# EAGLE schematic ws2812_wyswietlacz (EAGLE 9.2.0)
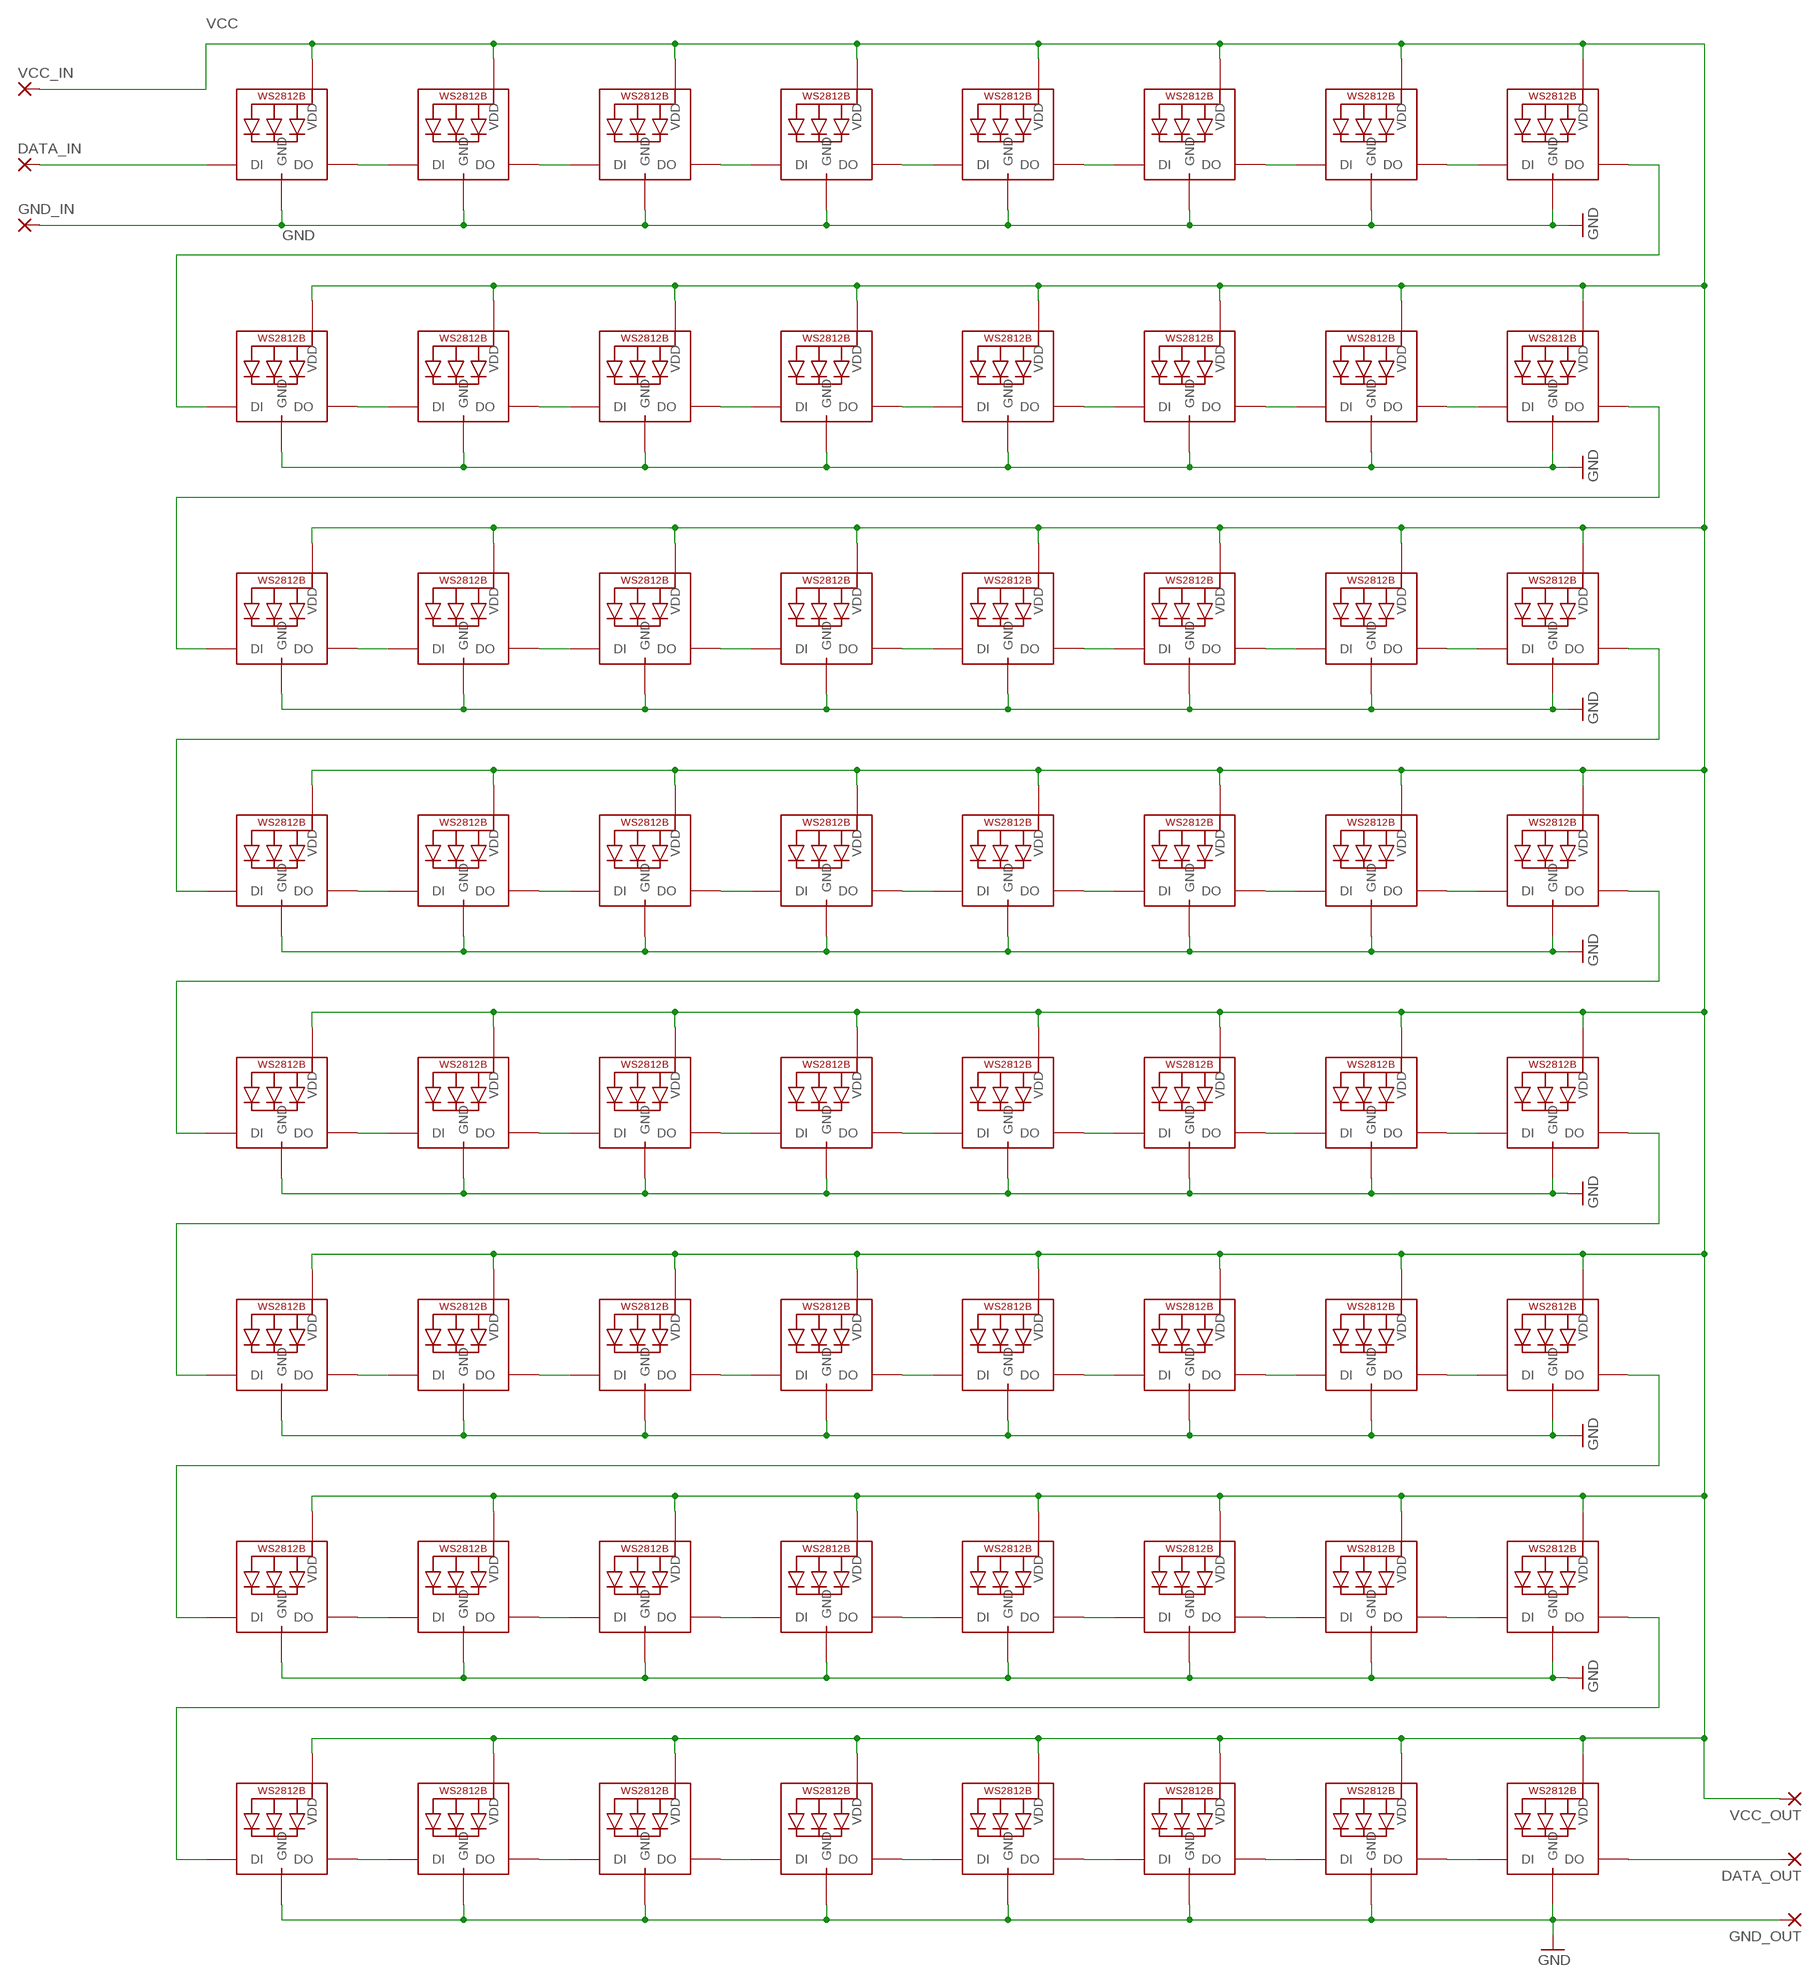
[diagram p0: schematic, sheet 1]

## Parts
DATA_IN  2,54/1,0  [2,54/1,0]
DATA_OUT  2,54/1,0  [2,54/1,0]
GND_IN  2,54/1,0  [2,54/1,0]
GND_OUT  2,54/1,0  [2,54/1,0]
LED1  WS2812B_5050N  [WS2812B-NARROW]
LED2  WS2812B_5050N  [WS2812B-NARROW]
LED3  WS2812B_5050N  [WS2812B-NARROW]
LED4  WS2812B_5050N  [WS2812B-NARROW]
LED5  WS2812B_5050N  [WS2812B-NARROW]
LED6  WS2812B_5050N  [WS2812B-NARROW]
LED7  WS2812B_5050N  [WS2812B-NARROW]
LED8  WS2812B_5050N  [WS2812B-NARROW]
LED9  WS2812B_5050N  [WS2812B-NARROW]
LED10  WS2812B_5050N  [WS2812B-NARROW]
LED11  WS2812B_5050N  [WS2812B-NARROW]
LED12  WS2812B_5050N  [WS2812B-NARROW]
LED13  WS2812B_5050N  [WS2812B-NARROW]
LED14  WS2812B_5050N  [WS2812B-NARROW]
LED15  WS2812B_5050N  [WS2812B-NARROW]
LED16  WS2812B_5050N  [WS2812B-NARROW]
LED17  WS2812B_5050N  [WS2812B-NARROW]
LED18  WS2812B_5050N  [WS2812B-NARROW]
LED19  WS2812B_5050N  [WS2812B-NARROW]
LED20  WS2812B_5050N  [WS2812B-NARROW]
LED21  WS2812B_5050N  [WS2812B-NARROW]
LED22  WS2812B_5050N  [WS2812B-NARROW]
LED23  WS2812B_5050N  [WS2812B-NARROW]
LED24  WS2812B_5050N  [WS2812B-NARROW]
LED25  WS2812B_5050N  [WS2812B-NARROW]
LED26  WS2812B_5050N  [WS2812B-NARROW]
LED27  WS2812B_5050N  [WS2812B-NARROW]
LED28  WS2812B_5050N  [WS2812B-NARROW]
LED29  WS2812B_5050N  [WS2812B-NARROW]
LED30  WS2812B_5050N  [WS2812B-NARROW]
LED31  WS2812B_5050N  [WS2812B-NARROW]
LED32  WS2812B_5050N  [WS2812B-NARROW]
LED33  WS2812B_5050N  [WS2812B-NARROW]
LED34  WS2812B_5050N  [WS2812B-NARROW]
LED35  WS2812B_5050N  [WS2812B-NARROW]
LED36  WS2812B_5050N  [WS2812B-NARROW]
LED37  WS2812B_5050N  [WS2812B-NARROW]
LED38  WS2812B_5050N  [WS2812B-NARROW]
LED39  WS2812B_5050N  [WS2812B-NARROW]
LED40  WS2812B_5050N  [WS2812B-NARROW]
LED41  WS2812B_5050N  [WS2812B-NARROW]
LED42  WS2812B_5050N  [WS2812B-NARROW]
LED43  WS2812B_5050N  [WS2812B-NARROW]
LED44  WS2812B_5050N  [WS2812B-NARROW]
LED45  WS2812B_5050N  [WS2812B-NARROW]
LED46  WS2812B_5050N  [WS2812B-NARROW]
LED47  WS2812B_5050N  [WS2812B-NARROW]
LED48  WS2812B_5050N  [WS2812B-NARROW]
LED49  WS2812B_5050N  [WS2812B-NARROW]
LED50  WS2812B_5050N  [WS2812B-NARROW]
LED51  WS2812B_5050N  [WS2812B-NARROW]
LED52  WS2812B_5050N  [WS2812B-NARROW]
LED53  WS2812B_5050N  [WS2812B-NARROW]
LED54  WS2812B_5050N  [WS2812B-NARROW]
LED55  WS2812B_5050N  [WS2812B-NARROW]
LED56  WS2812B_5050N  [WS2812B-NARROW]
LED57  WS2812B_5050N  [WS2812B-NARROW]
LED58  WS2812B_5050N  [WS2812B-NARROW]
LED59  WS2812B_5050N  [WS2812B-NARROW]
LED60  WS2812B_5050N  [WS2812B-NARROW]
LED61  WS2812B_5050N  [WS2812B-NARROW]
LED62  WS2812B_5050N  [WS2812B-NARROW]
LED63  WS2812B_5050N  [WS2812B-NARROW]
LED64  WS2812B_5050N  [WS2812B-NARROW]
VCC_IN  2,54/1,0  [2,54/1,0]
VCC_OUT  2,54/1,0  [2,54/1,0]

## Nets
GND: GND_IN.1(P) GND_OUT.1(P) LED1.3-GND(GND) LED2.3-GND(GND) LED3.3-GND(GND) LED4.3-GND(GND) LED5.3-GND(GND) LED6.3-GND(GND) LED7.3-GND(GND) LED8.3-GND(GND) LED9.3-GND(GND) LED10.3-GND(GND) LED11.3-GND(GND) LED12.3-GND(GND) LED13.3-GND(GND) LED14.3-GND(GND) LED15.3-GND(GND) LED16.3-GND(GND) LED17.3-GND(GND) LED18.3-GND(GND) LED19.3-GND(GND) LED20.3-GND(GND) LED21.3-GND(GND) LED22.3-GND(GND) LED23.3-GND(GND) LED24.3-GND(GND) LED25.3-GND(GND) LED26.3-GND(GND) LED27.3-GND(GND) LED28.3-GND(GND) LED29.3-GND(GND) LED30.3-GND(GND) LED31.3-GND(GND) LED32.3-GND(GND) LED33.3-GND(GND) LED34.3-GND(GND) LED35.3-GND(GND) LED36.3-GND(GND) LED37.3-GND(GND) LED38.3-GND(GND) LED39.3-GND(GND) LED40.3-GND(GND) LED41.3-GND(GND) LED42.3-GND(GND) LED43.3-GND(GND) LED44.3-GND(GND) LED45.3-GND(GND) LED46.3-GND(GND) LED47.3-GND(GND) LED48.3-GND(GND) LED49.3-GND(GND) LED50.3-GND(GND) LED51.3-GND(GND) LED52.3-GND(GND) LED53.3-GND(GND) LED54.3-GND(GND) LED55.3-GND(GND) LED56.3-GND(GND) LED57.3-GND(GND) LED58.3-GND(GND) LED59.3-GND(GND) LED60.3-GND(GND) LED61.3-GND(GND) LED62.3-GND(GND) LED63.3-GND(GND) LED64.3-GND(GND)
N$1: DATA_IN.1(P) LED1.4-DIN(DI)
N$2: DATA_OUT.1(P) LED64.2-DOUT(DO)
N$3: LED1.2-DOUT(DO) LED2.4-DIN(DI)
N$4: LED2.2-DOUT(DO) LED3.4-DIN(DI)
N$5: LED3.2-DOUT(DO) LED4.4-DIN(DI)
N$6: LED4.2-DOUT(DO) LED5.4-DIN(DI)
N$7: LED5.2-DOUT(DO) LED6.4-DIN(DI)
N$8: LED6.2-DOUT(DO) LED7.4-DIN(DI)
N$9: LED7.2-DOUT(DO) LED8.4-DIN(DI)
N$10: LED8.2-DOUT(DO) LED9.4-DIN(DI)
N$13: LED9.2-DOUT(DO) LED10.4-DIN(DI)
N$14: LED10.2-DOUT(DO) LED11.4-DIN(DI)
N$15: LED11.2-DOUT(DO) LED12.4-DIN(DI)
N$16: LED12.2-DOUT(DO) LED13.4-DIN(DI)
N$17: LED13.2-DOUT(DO) LED14.4-DIN(DI)
N$18: LED14.2-DOUT(DO) LED15.4-DIN(DI)
N$19: LED15.2-DOUT(DO) LED16.4-DIN(DI)
N$20: LED16.2-DOUT(DO) LED17.4-DIN(DI)
N$23: LED17.2-DOUT(DO) LED18.4-DIN(DI)
N$24: LED18.2-DOUT(DO) LED19.4-DIN(DI)
N$25: LED19.2-DOUT(DO) LED20.4-DIN(DI)
N$26: LED20.2-DOUT(DO) LED21.4-DIN(DI)
N$27: LED21.2-DOUT(DO) LED22.4-DIN(DI)
N$28: LED22.2-DOUT(DO) LED23.4-DIN(DI)
N$29: LED23.2-DOUT(DO) LED24.4-DIN(DI)
N$30: LED24.2-DOUT(DO) LED25.4-DIN(DI)
N$33: LED25.2-DOUT(DO) LED26.4-DIN(DI)
N$34: LED26.2-DOUT(DO) LED27.4-DIN(DI)
N$35: LED27.2-DOUT(DO) LED28.4-DIN(DI)
N$36: LED28.2-DOUT(DO) LED29.4-DIN(DI)
N$37: LED29.2-DOUT(DO) LED30.4-DIN(DI)
N$38: LED30.2-DOUT(DO) LED31.4-DIN(DI)
N$39: LED31.2-DOUT(DO) LED32.4-DIN(DI)
N$40: LED32.2-DOUT(DO) LED33.4-DIN(DI)
N$43: LED33.2-DOUT(DO) LED34.4-DIN(DI)
N$44: LED34.2-DOUT(DO) LED35.4-DIN(DI)
N$45: LED35.2-DOUT(DO) LED36.4-DIN(DI)
N$46: LED36.2-DOUT(DO) LED37.4-DIN(DI)
N$47: LED37.2-DOUT(DO) LED38.4-DIN(DI)
N$48: LED38.2-DOUT(DO) LED39.4-DIN(DI)
N$49: LED39.2-DOUT(DO) LED40.4-DIN(DI)
N$50: LED40.2-DOUT(DO) LED41.4-DIN(DI)
N$53: LED41.2-DOUT(DO) LED42.4-DIN(DI)
N$54: LED42.2-DOUT(DO) LED43.4-DIN(DI)
N$55: LED43.2-DOUT(DO) LED44.4-DIN(DI)
N$56: LED44.2-DOUT(DO) LED45.4-DIN(DI)
N$57: LED45.2-DOUT(DO) LED46.4-DIN(DI)
N$58: LED46.2-DOUT(DO) LED47.4-DIN(DI)
N$59: LED47.2-DOUT(DO) LED48.4-DIN(DI)
N$60: LED48.2-DOUT(DO) LED49.4-DIN(DI)
N$63: LED49.2-DOUT(DO) LED50.4-DIN(DI)
N$64: LED50.2-DOUT(DO) LED51.4-DIN(DI)
N$65: LED51.2-DOUT(DO) LED52.4-DIN(DI)
N$66: LED52.2-DOUT(DO) LED53.4-DIN(DI)
N$67: LED53.2-DOUT(DO) LED54.4-DIN(DI)
N$68: LED54.2-DOUT(DO) LED55.4-DIN(DI)
N$69: LED55.2-DOUT(DO) LED56.4-DIN(DI)
N$70: LED56.2-DOUT(DO) LED57.4-DIN(DI)
N$73: LED57.2-DOUT(DO) LED58.4-DIN(DI)
N$74: LED58.2-DOUT(DO) LED59.4-DIN(DI)
N$75: LED59.2-DOUT(DO) LED60.4-DIN(DI)
N$76: LED60.2-DOUT(DO) LED61.4-DIN(DI)
N$77: LED61.2-DOUT(DO) LED62.4-DIN(DI)
N$78: LED62.2-DOUT(DO) LED63.4-DIN(DI)
N$79: LED63.2-DOUT(DO) LED64.4-DIN(DI)
VCC: LED1.1-VDD(VDD) LED2.1-VDD(VDD) LED3.1-VDD(VDD) LED4.1-VDD(VDD) LED5.1-VDD(VDD) LED6.1-VDD(VDD) LED7.1-VDD(VDD) LED8.1-VDD(VDD) LED9.1-VDD(VDD) LED10.1-VDD(VDD) LED11.1-VDD(VDD) LED12.1-VDD(VDD) LED13.1-VDD(VDD) LED14.1-VDD(VDD) LED15.1-VDD(VDD) LED16.1-VDD(VDD) LED17.1-VDD(VDD) LED18.1-VDD(VDD) LED19.1-VDD(VDD) LED20.1-VDD(VDD) LED21.1-VDD(VDD) LED22.1-VDD(VDD) LED23.1-VDD(VDD) LED24.1-VDD(VDD) LED25.1-VDD(VDD) LED26.1-VDD(VDD) LED27.1-VDD(VDD) LED28.1-VDD(VDD) LED29.1-VDD(VDD) LED30.1-VDD(VDD) LED31.1-VDD(VDD) LED32.1-VDD(VDD) LED33.1-VDD(VDD) LED34.1-VDD(VDD) LED35.1-VDD(VDD) LED36.1-VDD(VDD) LED37.1-VDD(VDD) LED38.1-VDD(VDD) LED39.1-VDD(VDD) LED40.1-VDD(VDD) LED41.1-VDD(VDD) LED42.1-VDD(VDD) LED43.1-VDD(VDD) LED44.1-VDD(VDD) LED45.1-VDD(VDD) LED46.1-VDD(VDD) LED47.1-VDD(VDD) LED48.1-VDD(VDD) LED49.1-VDD(VDD) LED50.1-VDD(VDD) LED51.1-VDD(VDD) LED52.1-VDD(VDD) LED53.1-VDD(VDD) LED54.1-VDD(VDD) LED55.1-VDD(VDD) LED56.1-VDD(VDD) LED57.1-VDD(VDD) LED58.1-VDD(VDD) LED59.1-VDD(VDD) LED60.1-VDD(VDD) LED61.1-VDD(VDD) LED62.1-VDD(VDD) LED63.1-VDD(VDD) LED64.1-VDD(VDD) VCC_IN.1(P) VCC_OUT.1(P)

## Library data of the parts
DATA_IN DATA_OUT GND_IN GND_OUT VCC_IN VCC_OUT = wirepad:2,54/1,0: THROUGH-HOLE PAD
LED1-LED64 = adafruit:WS2812B